# EAGLE design breadboard-psu (EAGLE 7.2.0)
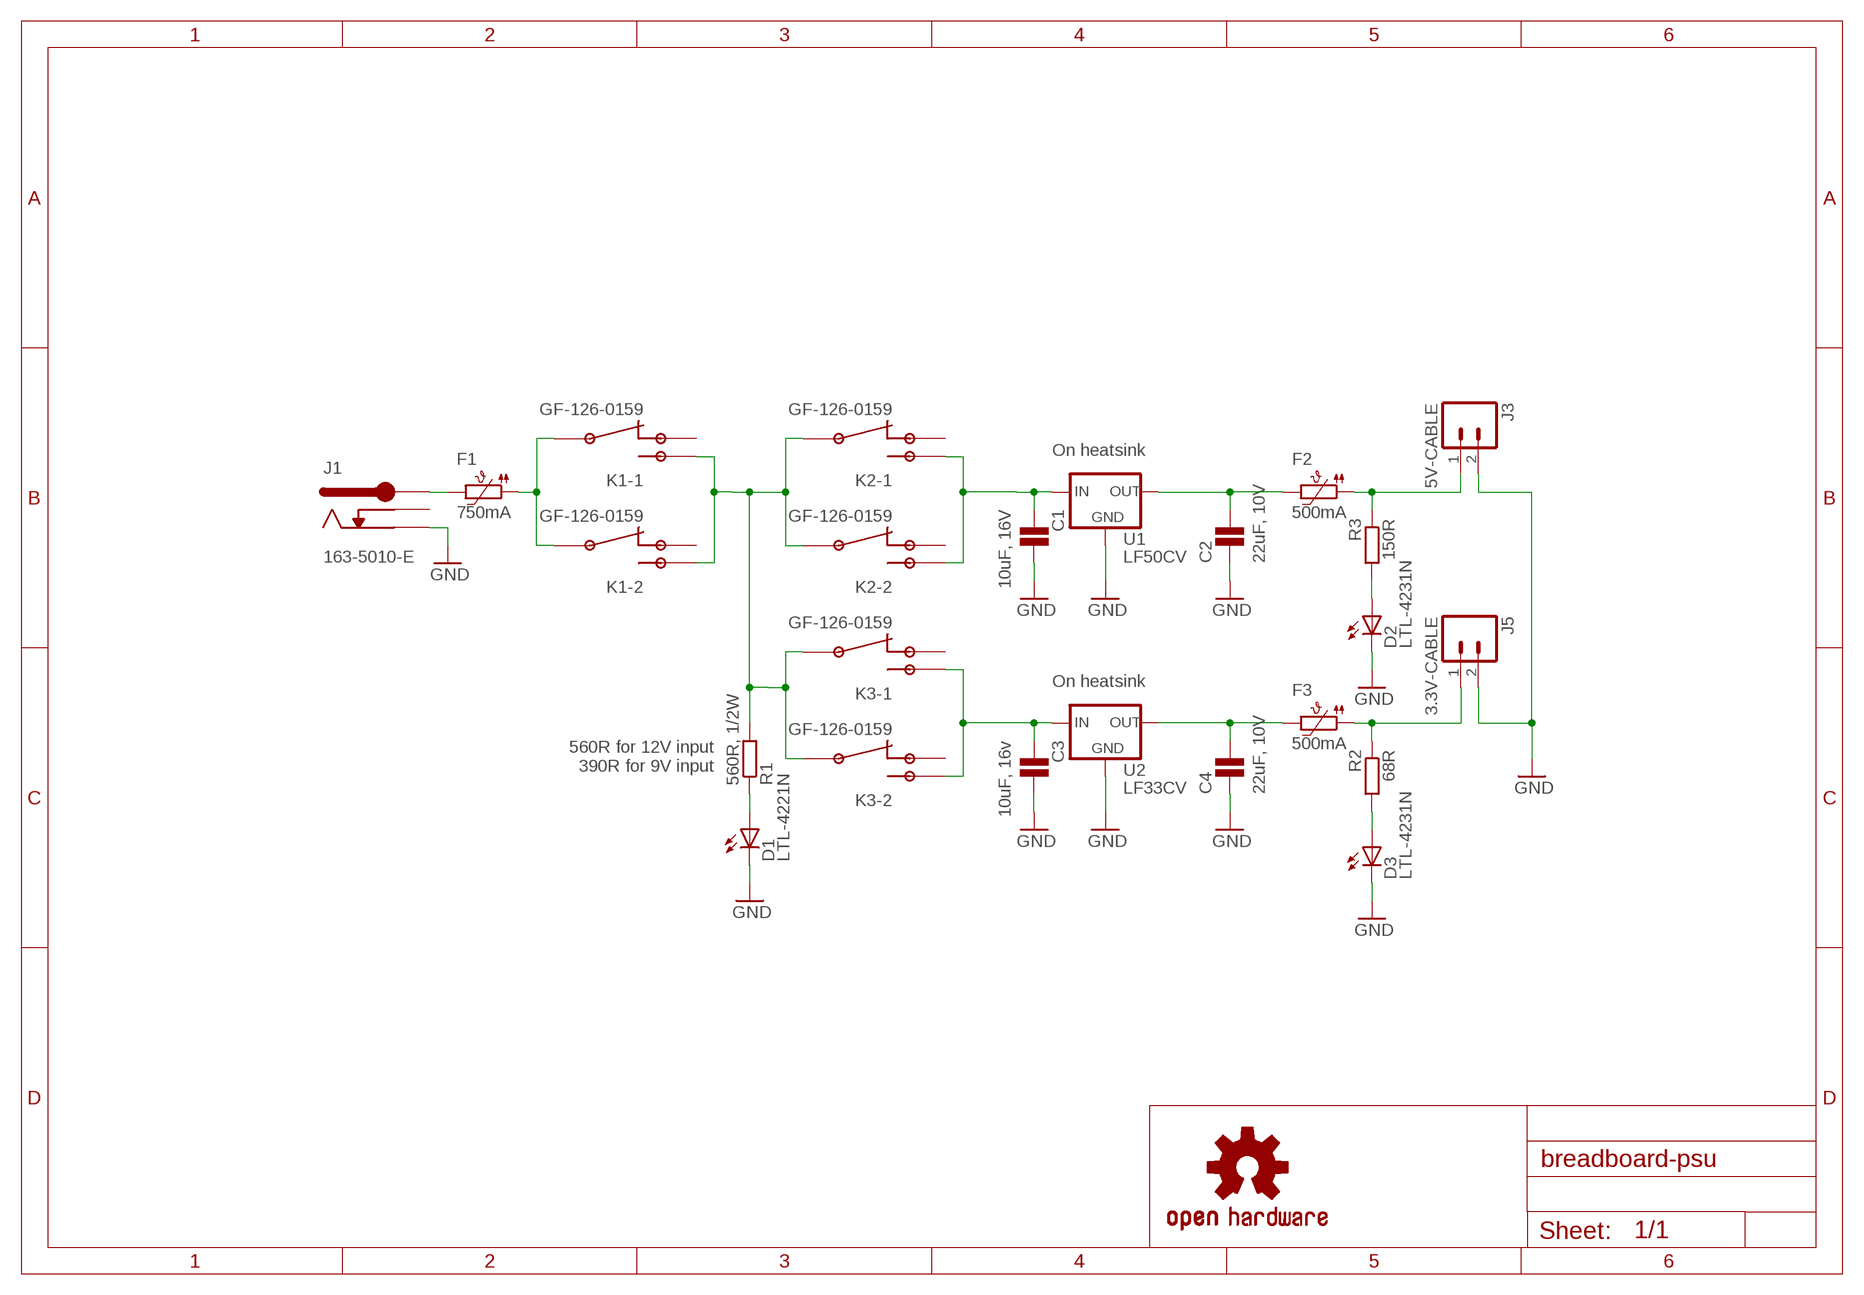
[diagram p0: schematic, sheet 1]

## Parts
C1  10uF, 16V  FK26X7R  [FK26*]
C2  22uF, 10V  FK20X7R  [FK20*]
C3  10uF, 16v  FK26X7R  [FK26*]
C4  22uF, 10V  FK20X7R  [FK20*]
D1  LTL-4221N  LED3MM  [LED3MM]
D2  LTL-4231N  LED3MM  [LED3MM]
D3  LTL-4231N  LED3MM  [LED3MM]
F1  750mA  RXEF  [AXIAL__GENERIC_10X3]
F2  500mA  RXEF  [AXIAL__GENERIC_10X3]
F3  500mA  RXEF  [AXIAL__GENERIC_10X3]
J1  163-5010-E  [163-501*-E]
J3  5V-CABLE  M02POLAR  [MOLEX-1X2]
J5  3.3V-CABLE  M02POLAR  [MOLEX-1X2]
K1  GF-126-0159  [GF-126-0159]
K2  GF-126-0159  [GF-126-0159]
K3  GF-126-0159  [GF-126-0159]
LOGO2  OSHW-LOGOL  [OSHW-LOGO-L]
R1  560R, 1/2W  R-EU_0204/2V  [0204V]
R2  68R  R-EU_0204/2V  [0204V]
R3  150R  R-EU_0204/2V  [0204V]
U1  LF50CV  V_REG_78XXSINK  [TO220-IGO]
U2  LF33CV  V_REG_78XXSINK  [TO220-IGO]

## Nets
3V3 [power]: F3.P$1 J5.1 R2.1
5V [power]: F2.P$1 J3.1 R3.1
GND: C1.P$2 C2.P$1 C3.P$2 C4.P$1 D1.K(C) D2.K(C) D3.K(C) J1.P$1(-) J3.2 J5.2 U1.GND U2.GND
N$1 [power]: F1.P$2 J1.P$4(+)
N$2 [power]: F1.P$1 K1.P$2 K1.P$5
N$3 [power]: K1.P$3 K1.P$6 K2.P$2 K2.P$5 K3.P$2 K3.P$5 R1.2
N$4 [power]: C1.P$1 K2.P$3 K2.P$6 U1.IN
N$5 [power]: C3.P$1 K3.P$3 K3.P$6 U2.IN
N$6 [power]: C2.P$2 F2.P$2 U1.OUT
N$7 [power]: C4.P$2 F3.P$2 U2.OUT
N$9: D1.A R1.1
N$10: D2.A R3.2
N$13: D3.A R2.2
Unconnected: J1.P$2(DISCONNECT) J1.P$3(DISCONNECT) K1.P$1 K1.P$4 K2.P$1 K2.P$4 K3.P$1 K3.P$4

## Notes on the sheet
- On heatsink
- On heatsink
- 560R for 12V input
  390R for 9V input

## Library data of the parts
C1 C3 = radu-collected:FK26*: TDK FK26* MLCC leaded capacitor
C2 C4 = radu-collected:FK20*: TDK FK20* MLCC leaded capacitor
D1-D3 = led:LED: LED OSRAM: - CHIPLED LG R971, LG N971, LY N971, LG Q971, LY Q971, LO R971, LY R971 LH N974, LH R974 LS Q976, LO Q976, LY Q976 LO Q996 - Hyper CHIPLED LW Q18S LB Q993, LB Q99A, LB R99A - SideLED LS A670, LO A670, LY A670, LG A670, LP A670 LB A673, LV A673, LT A673, LW A673 LH A674 LY A675 LS A676, LA A676, LO A676, LY A676, LW A676 LS A679, LY A679, LG A679 - Hyper Micro SIDELED® LS Y876, LA Y876, LO Y876, LY Y876 LT Y87S - SmartLED LW L88C, LW L88S LB L89C, LB L89S, LG L890 LS L89K, LO L89K, LY L89K LS L896, LA L896, LO L896, LY L896 - TOPLED LS T670, LO T670, LY T670, LG T670, LP T670 LSG T670, LSP T670, LSY T670, LOP T670, LYG T670 LG T671, LOG T671, LSG T671 LB T673, LV T673, LT T673, LW T673 LH T674 LS T676, LA T676, LO T676, LY T676, LB T676, LH T676, LSB T676, LW T676 LB T67C, LV T67C, LT T67C, LS T67K, LO T67K, LY T67K, LW E67C LS E67B, LA E67B, LO E67B, LY E67B, LB E67C, LV E67C, LT E67C LW T67C LS T679, LY T679, LG T679 LS T770, LO T770, LY T770, LG T770, LP T770 LB T773, LV T773, LT T773, LW T773 LH T774 LS E675, LA E675, LY E675, LS T675 LS T776, LA T776, LO T776, LY T776, LB T776 LHGB T686 LT T68C, LB T68C - Hyper Mini TOPLED® LB M676 - Mini TOPLED Santana® LG M470 LS M47K, LO M47K, LY M47K Source: http://www.osram.convergy.de LUXEON: - LUMILED® LXK2-PW12-R00, LXK2-PW12-S00, LXK2-PW14-U00, LXK2-PW14-V00 LXK2-PM12-R00, LXK2-PM12-S00, LXK2-PM14-U00 LXK2-PE12-Q00, LXK2-PE12-R00, LXK2-PE12-S00, LXK2-PE14-T00, LXK2-PE14-U00 LXK2-PB12-K00, LXK2-PB12-L00, LXK2-PB12-M00, LXK2-PB14-N00, LXK2-PB14-P00, LXK2-PB14-Q00 LXK2-PR12-L00, LXK2-PR12-M00, LXK2-PR14-Q00, LXK2-PR14-R00 LXK2-PD12-Q00, LXK2-PD12-R00, LXK2-PD12-S00 LXK2-PH12-R00, LXK2-PH12-S00 LXK2-PL12-P00, LXK2-PL12-Q00, LXK2-PL12-R00 Source: www.luxeon.com KINGBRIGHT: KA-3528ASYC Source: www.kingbright.com
F1-F3 = radu-collected:RXEF*: TE Connectivity PolySwitch Resettable Devices These are PPTCs or polyfuses, RXEF series.
J1 = radu-collected:163-501*-E: Kobiconn 163-501[01]-E auto-disconnecting DC power jack 163-5010-E has a 2mm center pin while 163-5011-E has a 2.5mm one
J3 J5 = SparkFun-Connectors:M02: Standard 2-pin 0.1" header. Use with - straight break away headers ( PRT-00116) - right angle break away headers (PRT-00553) - swiss pins (PRT-00743) - machine pins (PRT-00117) - female headers (PRT-00115) Molex polarized connector foot print use with: PRT-08233 with associated crimp pins and housings. 2.54_SCREWTERM for use with PRT-10571. 3.5mm Screw Terminal footprints for PRT-08084 5mm Screw Terminal footprints for use with PRT-08432
K1-K3 = radu-collected:GF-126-0159: CW Industries GF-126-0159 DPDT slide switch
LOGO2 = SparkFun-Aesthetics:OSHW-LOGO: Open Source Hardware Logo This logo indicates the piece of hardware it is found on incorporates a OSHW license and/or adheres to the definition of open source hardware found here: http://freedomdefined.org/OSHW
R1-R3 = rcl:R-EU_: RESISTOR, European symbol
U1 U2 = SparkFun-PowerIC:V_REG_78XX: Voltage Regulator Standard 78xx regulator. IGO (Input Ground Output). Spark Fun Electronics SKU : COM-00107

## Net classes
1 power: width 0.762 mm

## Board
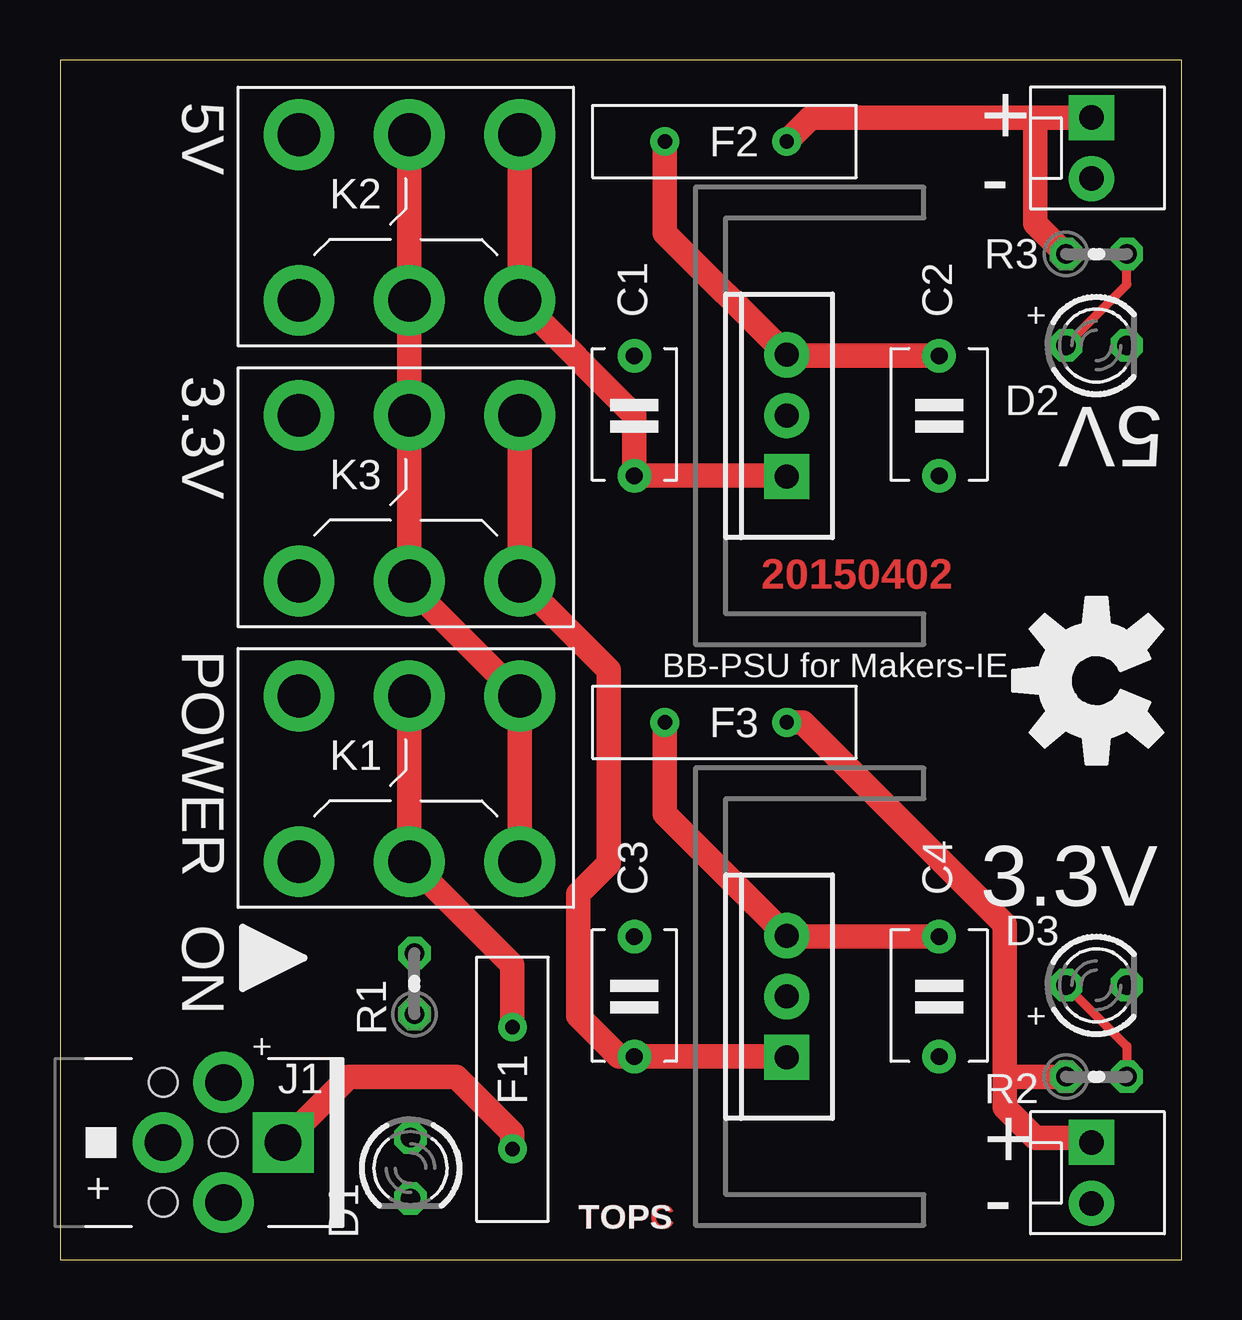
[diagram p1: board, top side]
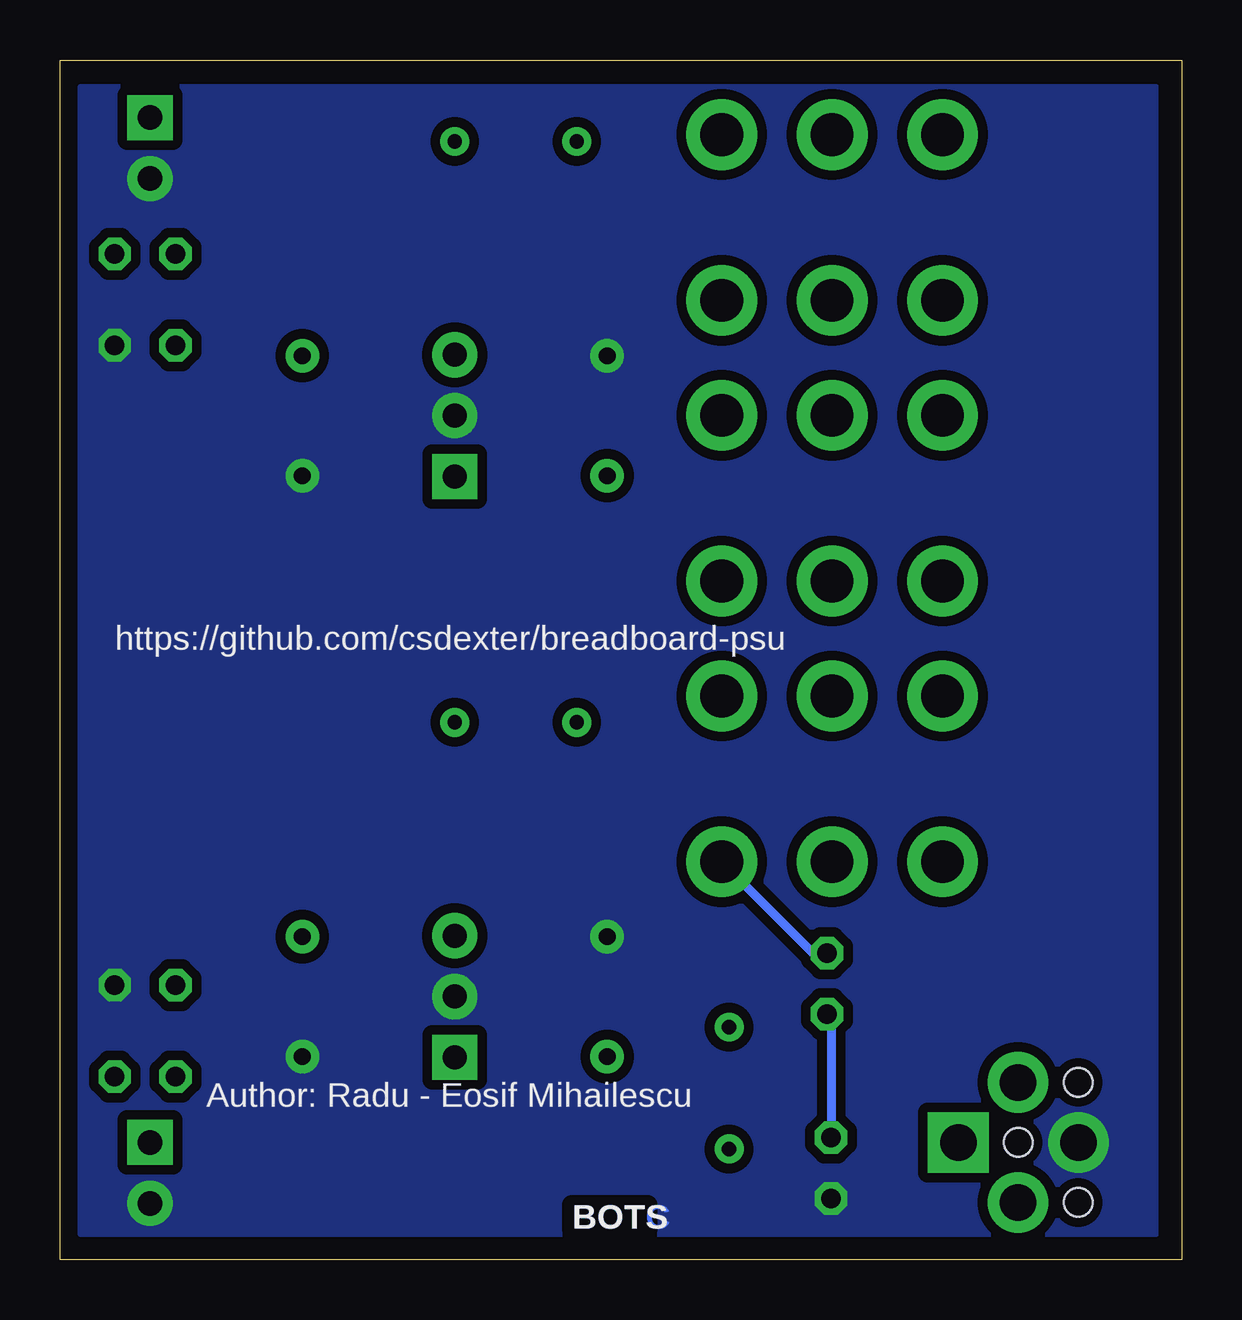
[diagram p2: board, bottom side, seen from below]

Size 46.73 x 50 mm. Coordinates in mm from the lower left corner, seen from the top.
Outline: 0,0 46.73,0 46.73,50 0,50 0,0
Copper layers (1*16): Top 0.035mm / dielectric 1.5mm / Bottom 0.035mm
Design rules "SeeedStudio_2layer_DRU_no_angle_20140221 *": minimum track width 6mil, minimum drill 12mil, track to track 10mil, track to pad 10mil, pad to pad 10mil, via to via 10mil, smd to smd 0mil, copper to edge 10mil, drill to drill 10mil, minimum pad ring 10mil, minimum via ring 6mil, stop-mask expansion 2mil, vias tented up to drill 100mil, thermal gap 10mil

### Footprints (pad centres in the part's own frame; a part is rotated, then mirrored left to right if it is on the bottom)
FK26* = drill 0.7 pad 1.4: P$1 -2.5,0; P$2 2.5,0
FK20* = drill 0.7 pad 1.4: P$1 -2.5,0; P$2 2.5,0
LED3MM = drill 0.813 octagon: A -1.27,0; K 1.27,0
AXIAL__GENERIC_10X3 = drill 0.6 pad 1.2: P$1 -2.54,0; P$2 2.54,0
163-501*-E = drill 1.524: P$1 4.496,0; P$2 7.01,2.502; P$3 7.01,-2.502 | drill 1.524 square: P$4 9.5,0 | hole 1.194: 7.01,0; 4.496,2.502; 4.496,-2.502
MOLEX-1X2 = drill 1.016 pad 1.88 square: 1 0,0 | drill 1.016 pad 1.88: 2 2.54,0
GF-126-0159 = drill 1.778: P$1 0,0; P$2 4.597,0; P$3 9.195,0; P$4 0,6.909; P$5 4.597,6.909; P$6 9.195,6.909
0204V = drill 0.813 octagon: 1 -1.27,0; 2 1.27,0
TO220-IGO = drill 1 pad 1.88: GND 0,0; OUT 2.54,0 | drill 1 pad 1.88 square: IN -2.54,0

### Placement (x,y rotation side)
C1  23.93,35.17 90 top
C2  36.63,35.17 90 top
C3  23.93,10.96 90 top
C4  36.63,10.96 90 top
D1  14.61,3.81 270 top
D2  43.18,38.1 0 top
D3  43.18,11.43 0 top
F1  18.85,7.15 270 top
F2  27.74,46.6 180 top
F3  27.74,22.39 180 top
J1  -0.2,4.88 0 top
J3  42.98,47.6 270 top
J5  42.98,4.88 270 top
K1  9.96,16.58 0 top
K2  9.96,39.98 0 top
K3  9.96,28.28 0 top
LOGO2  43.18,24.13 90 top
R1  14.77,11.5 90 top
R2  43.18,7.62 0 top
R3  43.18,41.91 0 top
U1  30.28,35.17 90 top
U2  30.28,10.96 90 top

### Tracks (layer width: path | path; a pad name or v marks a point on that pad's centre or on a via)
3V3
  Top 1.016: F3.P$1 30.95,22.39 39.37,13.97 39.37,7.62 | 39.37,7.62 39.37,6.35 40.64,5.08 42.78,5.08 J5.1 | R2.1 39.37,7.62
5V
  Top 1.016: F2.P$1 31.28,47.6 40.64,47.6 | 40.64,47.6 J3.1 | R3.1 40.64,43.18 40.64,47.6
GND
  pour Bottom (isolate 0.406, no thermals): 1.07,48.87 45.88,48.87 45.88,1.07 1.07,1.07
N$1
  Top 1.016: J1.P$4 12.04,7.62 16.51,7.62 18.85,5.28 F1.P$2
N$2
  Top 1.016: K1.P$5 K1.P$2 18.85,12.29 F1.P$1
N$3
  Top 1.016: K2.P$5 K2.P$2 K3.P$5 K3.P$2 14.56,28.09 K1.P$6 K1.P$3
  Bottom 0.381: K1.P$3 15.35,12.77 R1.2
N$4
  Top 1.016: U1.IN 30.28,32.67 C1.P$1 23.93,35.2 K2.P$3 K2.P$6
N$5
  Top 1.016: U2.IN 30.28,8.46 C3.P$1 23.29,8.46 21.59,10.16 21.59,15.24 22.86,16.51 22.86,24.57 K3.P$3 K3.P$6
N$6
  Top 1.016: C2.P$2 30.28,37.67 U1.OUT 25.2,42.79 F2.P$2
N$7
  Top 1.016: C4.P$2 30.28,13.46 U2.OUT 25.2,18.58 F3.P$2
N$9
  Bottom 0.381: R1.1 14.61,10.06 D1.A
N$10
  Top 0.381: D2.A 44.45,40.64 R3.2
N$13
  Top 0.381: D3.A 44.45,8.89 R2.2

### Text on the board
Top: 20150402 | TOPC
Bottom: BOTC
tPlace: 5V | + | - | + | 3.3V | 5V | POWER | BB-PSU for Makers-IE | 3.3V | ON | + | + | + | TOPS | -
bPlace: https://github.com/csdexter/breadboard-psu | Author: Radu - Eosif Mihailescu | BOTS